# Altium project PowCapMobile.PrjPCB (part 2 of 3)
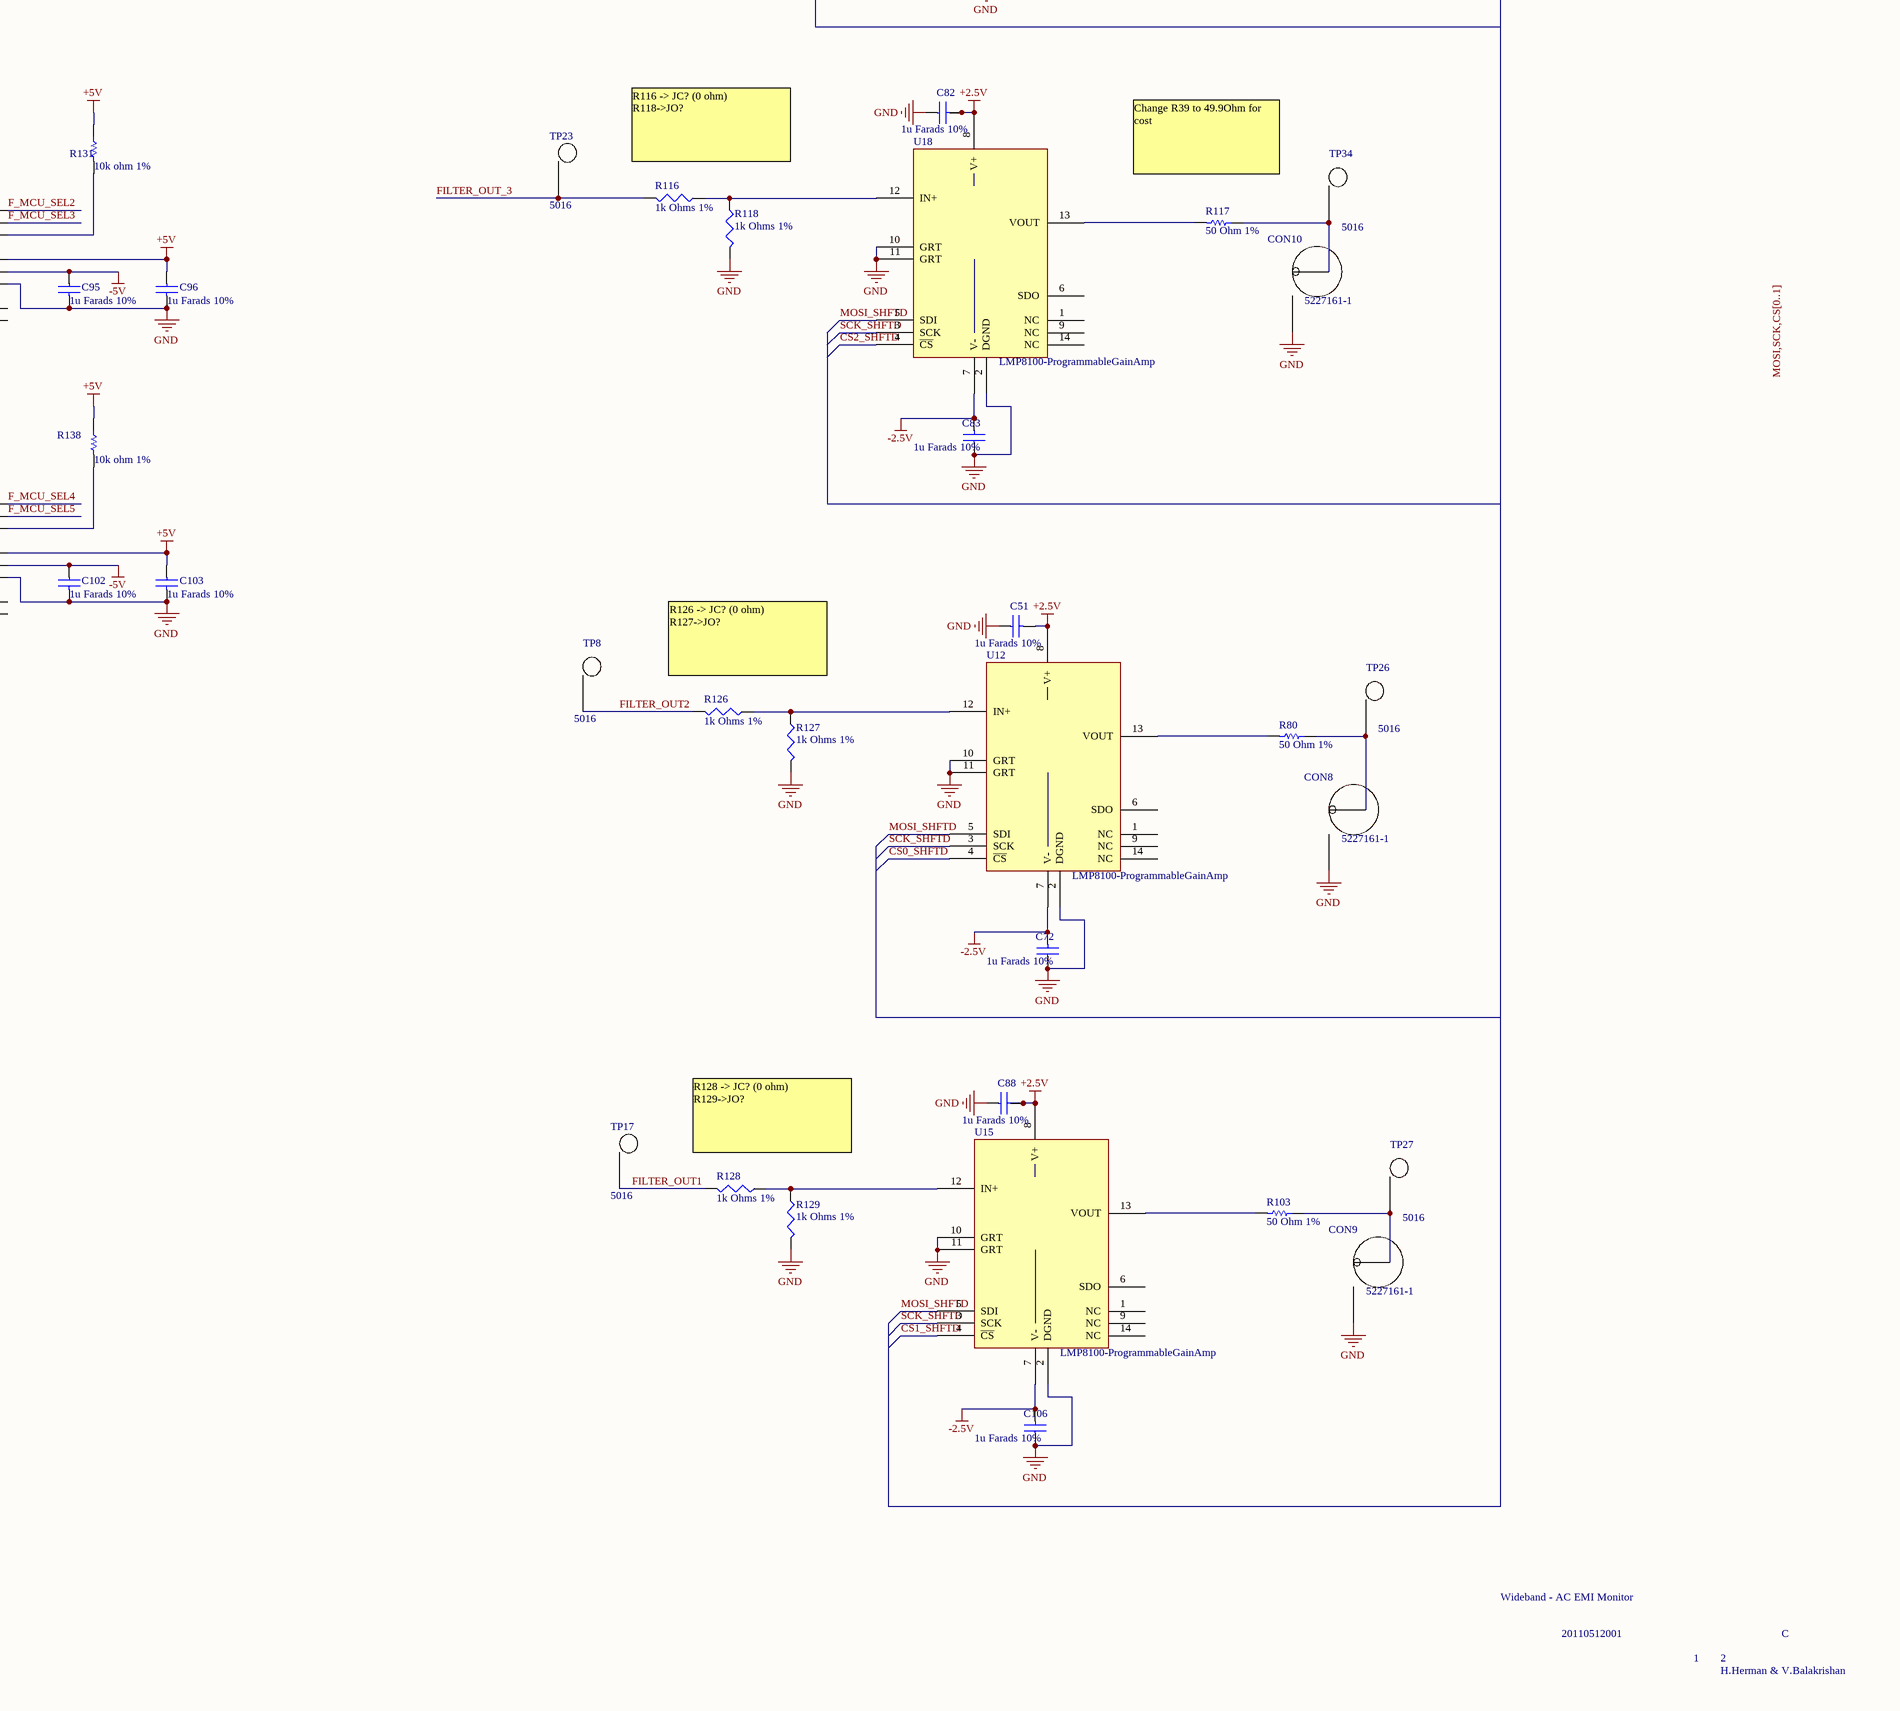
[diagram p9: PowCapMobile.SchDoc, bottom right]

## Sheet PowCapMobile.SchDoc (continued)
### Library data of the parts
BOOT RESET = 2128: SW - SPST-NO - SM; mfrName: C&K Components; Extra_Description: PTS 525 Series / Microminiature Tact Switch for SMT; Obsolete: False; Temp_Max: 0; PartID: 2128; mfrPartNum: CKN9104CT-ND; mfrWebsite: http://digikey.com/Suppliers/us/C-and-K-Components.page?lang=EN; URL_Image: http://media.digikey.com/photos/CK%20Comp%20Photos/PTS525SM10SMTR.jpg; URL_Datasheet: http://www.ck-components.com/index.php?module=media&action=Display&cmpref=14407&lang=en&width=&height=&format=&alt=; Date_Created: 2/24/2011 10:42:02 PM; Date_LastModified: 2/24/2011 10:42:02 PM; Verified: False; RoHS: True; Temp_Min: 0; Type: Pushbutton (Push Button)
C1 C3 C6 C7 C13 C18 C24 C25 = 2178: capacitor, case c, 10uf, 25v; application:general purpose;; mfrName: Panasonic; mfrPartNum: EEE1EA100SR; Label: 1uF; Extra_Description: CAPACITOR, CASE C, 10UF, 25V; Application:General Purpose; Capacitance:10µF; Tolerance, Capacitance:± 20%; Series:VS; Voltage, Rating:25V dc; Capacitor Dielectric Type:Aluminium Electrolytic; Case Style:C; External Length / Height:5.4mm; Body Diameter:5mm; Lead Spacing:1.5mm; Termination Type:SMD; Operating Temperature Range:-40°C to +85°C; AC Ripple Current:28mA; External Depth:5.3mm; Lead Length:2.2mm; Leakage Current:3µA; Operating Lifetime:2000h; Power Factor:0.14; Power Factor Frequency:120Hz; Ripple Current Frequency:120Hz; Temp, Op. Max:85°C; Temp, Op. Min:-40°C; Temperature, Operating Life:85°C; Temperature, Ripple Current:85°C; Tolerance, +:20%; Tolerance, -:20%; Voltage Rating, DC:25V; Width, External:5.3mm; Width, Lead Cross-section:0.65mm; Width, Tape:12mm / Mounting Type: ``Surface Mount`` / Lead-Free Status: ``Lead Free`` / Packaging: ``Cut Tape (CT)`` / Dielectric Material: ``Aluminum Electrolytic`` / RoHS: ``Compliant`` / Size-Height: { / ``uncertainty_minus``: null, / ``value``: 0.0054, / ``uncertainty_plus``: null / } / Voltage Rating (DC): { / ``uncertainty_minus``: null, / ``value``: 25.0, / ``uncertainty_plus``: null / } / Lead Length: { / ``uncertainty_minus``: null, / ``value``: 0.0022, / ``uncertainty_plus``: null / } / Size-Diameter: { / ``uncertainty_minus``: null, / ``value``: 0.005, / ``uncertainty_plus``: null / } / Capacitance: { / ``uncertainty_minus``: null, / ``value``: 1E-05, / ``uncertainty_plus``: null / } / Capacitance Tolerance: { / ``max_value``: 20.0, / ``max_uncertainty_plus``: null, / ``min_value``: -20.0, / ``min_uncertainty_plus``: null, / ``max_uncertainty_minus``: null / } / Operating Temperature: { / ``max_value``: 85.0, / ``max_uncertainty_plus``: null, / ``min_value``: null, / ``min_uncertainty_plus``: null, / ``max_uncertainty_minus``: null / } / Number of Pins: 2; Obsolete: False; Temp_Max: 0; Type: All Parts; TypeNotes: Applies to all parts in the database; PartID: 2178; URL_Image: http://cdn.sigma.octopart.com/8896371/image/Panasonic-EEE1EA100SR.jpg; URL_Datasheet: http://datasheet.octopart.com/EEE1EA100SR-Panasonic-datasheet-5314063.pdf; Date_Created: 5/5/2011 2:23:52 AM; Date_LastModified: 5/5/2011 2:23:52 AM; Verified: False; RoHS: True; Temp_Min: 0
C2 C26 = 2198: cap aluminum 1000uf 25vdc 20% 12.5 x 13.5mm smd 1100ma 5000; mfrName: Panasonic; mfrPartNum: EEV-FK1E102Q; Label: 1uF; Extra_Description: CAP 1000UF 25V ELECT FK SMD / Mounting Type: ``Surface Mount`` / Lead-Free Status: ``Lead Free`` / Packaging: ``Cut Tape (CT)`` / RoHS: ``Compliant`` / Voltage Rating (DC): { / ``uncertainty_minus``: null, / ``value``: 25.0, / ``uncertainty_plus``: null / } / Size-Width: { / ``uncertainty_minus``: null, / ``value``: 0.0135, / ``uncertainty_plus``: null / } / Size-Length: { / ``uncertainty_minus``: null, / ``value``: 0.015, / ``uncertainty_plus``: null / } / Size-Height: { / ``uncertainty_minus``: null, / ``value``: 0.0135, / ``uncertainty_plus``: null / } / Size-Diameter: { / ``uncertainty_minus``: null, / ``value``: 0.0125, / ``uncertainty_plus``: null / } / Capacitance: { / ``uncertainty_minus``: null, / ``value``: 0.001, / ``uncertainty_plus``: null / } / Capacitance Tolerance: { / ``max_value``: 20.0, / ``max_uncertainty_plus``: null, / ``min_value``: -20.0, / ``min_uncertainty_plus``: null, / ``max_uncertainty_minus``: null / } / Operating Temperature: { / ``max_value``: 105.0, / ``max_uncertainty_plus``: null, / ``min_value``: null, / ``min_uncertainty_plus``: null, / ``max_uncertainty_minus``: null / }; Obsolete: False; Temp_Max: 0; Type: All Parts; TypeNotes: Applies to all parts in the database; PartID: 2198; URL_Image: http://cdn.sigma.octopart.com/8933382/image/Panasonic-EEV-FK1E102Q.jpg; URL_Datasheet: http://datasheet.octopart.com/EEV-FK1E102Q-Panasonic-datasheet-48.pdf; Date_Created: 5/7/2011 2:26:18 AM; Date_LastModified: 5/7/2011 2:26:18 AM; Verified: False; RoHS: True; Temp_Min: 0
C4 C5 C16 C17 C27-C30 C33-C36 C40 C44 C45 C48 C51 C58 C59 C62-C65 C72 C75-C83 C88 C91 C92 C95 C96 C101-C103 C106 C120 C121 = 2065: CAP CER 1.0UF 10V 10% X5R 0603; mfrName: Murata Electronics North America; mfrPartNum: GRM188R61A105KA61D; Extra_Description: Datasheets	Chip Monolithic Ceramic Caps Part Numbering / GRM Series Spec/Test Methods (1) / GRM188R61A105KA61 / Product Photos	0603 Murata MLCC Caps / Product Training Modules	High-Cap Multilayer Ceramic Capacitors / Catalog Drawings	GRM Series Top, Sides / Standard Package	10 / Category	Capacitors / Family	Ceramic / Series	GRM / Capacitance	1.0µF / Voltage - Rated	10V / Tolerance	±10% / Temperature Coefficient	X5R / Mounting Type	Surface Mount, MLCC / Operating Temperature	-55°C ~ 85°C / Features	- / Applications	General Purpose / Ratings	- / Package / Case	0603 (1608 Metric) / Size / Dimension	0.063`` L x 0.032`` W (1.60mm x 0.80mm) / Lead Spacing	- / Thickness	0.80mm / Packaging	Cut Tape (CT) / Lead Style	- / Catalog Page	1886 (US2010 Interactive) / 1886 (US2010 PDF) / Other Names	490-1543-1; Obsolete: False; Temp_Max: 0; Type: Ceramic; PartID: 2065; URL_Image: HTTP://MEDIA.DIGIKEY.COM/PHOTOS/MURATA%20PHOTOS/0603%20MURATA%20MLCC%20CAPS.JPG; URL_Datasheet: http://search.murata.co.jp/Ceramy/image/img/w_hinm/L0005E.pdf; Date_Created: 9/27/2010 4:47:48 PM; Date_LastModified: 9/27/2010 4:47:48 PM; Verified: False; RoHS: True; Temp_Min: 0
C8-C12 C14 C15 C19-C21 C31 C32 C37 C38 C42 C43 C46 C47 C52-C57 C60 C61 C68-C71 C107 C108 = 2205: capacitor ceramic 1000pf, 50v, c0g, 0603; dielectric; mfrName: AVX; mfrPartNum: 06035A102FAT2A; Label: 1uF; Extra_Description: CAPACITOR CERAMIC 1000PF, 50V, C0G, 0603; Dielectric Characteristic:C0G/NP0; Capacitance:1000pF; Capacitance Tolerance:± 1%; Voltage Rating:50V; Temperature Coefficient:0 ± 30ppm/°C; Capacitor Case Style:0603; No. of Pins:2 ;RoHS Compliant: Yes / Packaging: ``Tape`` / RoHS: ``Compliant`` / Voltage Rating (DC): { / ``uncertainty_minus``: null, / ``value``: 50.0, / ``uncertainty_plus``: null / } / Capacitance: { / ``uncertainty_minus``: null, / ``value``: 1E-09, / ``uncertainty_plus``: null / } / Capacitance Tolerance: { / ``max_value``: 1.0, / ``max_uncertainty_plus``: null, / ``min_value``: -1.0, / ``min_uncertainty_plus``: null, / ``max_uncertainty_minus``: null / } / Number of Pins: 2; Obsolete: False; Temp_Max: 0; Type: All Parts; TypeNotes: Applies to all parts in the database; PartID: 2205; URL_Image: http://cdn.sigma.octopart.com/8893021/image/AVX-06035A102FAT2A.jpg; URL_Datasheet: http://datasheet.octopart.com/06035A102FAT2A-AVX-datasheet-8446347.pdf; Date_Created: 5/8/2011 9:06:39 AM; Date_LastModified: 5/8/2011 9:06:39 AM; Verified: False; RoHS: True; Temp_Min: 0
C22 C23 C66 C67 = 2202: Y2 Caps 1uF Epocs; mfrName: EPCOS; mfrPartNum: B32026B3105K; Obsolete: False; Temp_Max: 0; Type: All Parts; TypeNotes: Applies to all parts in the database; Label: 1uF; PartID: 2202; Extra_Description: Y2 Caps 1uF Epocs; URL_Image: http://www.mouser.com/images/epcos/images/812007111135.jpg; URL_Datasheet: http://www.epcos.com/inf/20/20/db/fc_2009/Y2_B32021_026.pdf; Date_Created: 5/7/2011 9:37:20 PM; Date_LastModified: 5/7/2011 9:37:20 PM; Verified: False; RoHS: True; Temp_Min: 0
C39 C41 = 2187: ceramic multilayer capacitor; capacitor type:general; mfrName: AVX; mfrPartNum: 06031A220KAT2A; Label: 1uF; Extra_Description: Ceramic Multilayer Capacitor; Capacitor Type:General Purpose; Capacitance:22pF; Capacitance Tolerance:± 10%; Voltage Rating:100VDC; Capacitor Dielectric Type:Multilayer Ceramic; Package/Case:0603; Termination Type:SMD ;RoHS Compliant: Yes / Mounting Type: ``Surface Mount`` / Lead-Free Status: ``Lead Free`` / Packaging: ``Cut Tape (CT)`` / RoHS: ``Compliant`` / Size-Width: { / ``uncertainty_minus``: null, / ``value``: 0.00081, / ``uncertainty_plus``: null / } / Size-Length: { / ``uncertainty_minus``: null, / ``value``: 0.0016, / ``uncertainty_plus``: null / } / Size-Height: { / ``uncertainty_minus``: null, / ``value``: 0.00086, / ``uncertainty_plus``: null / } / Voltage Rating (DC): { / ``uncertainty_minus``: null, / ``value``: 100.0, / ``uncertainty_plus``: null / } / Capacitance: { / ``uncertainty_minus``: null, / ``value``: 2.2E-11, / ``uncertainty_plus``: null / } / Capacitance Tolerance: { / ``max_value``: 10.0, / ``max_uncertainty_plus``: null, / ``min_value``: -10.0, / ``min_uncertainty_plus``: null, / ``max_uncertainty_minus``: null / } / Operating Temperature: { / ``max_value``: 125.0, / ``max_uncertainty_plus``: null, / ``min_value``: null, / ``min_uncertainty_plus``: null, / ``max_uncertainty_minus``: null / } / Number of Pins: 2; Obsolete: False; Temp_Max: 0; Type: All Parts; TypeNotes: Applies to all parts in the database; PartID: 2187; URL_Image: http://cdn.sigma.octopart.com/8893021/image/AVX-06031A220KAT2A.jpg; URL_Datasheet: http://datasheet.octopart.com/06031A220KAT2A-AVX-datasheet-118583.pdf; Date_Created: 5/5/2011 6:57:51 AM; Date_LastModified: 5/5/2011 6:57:51 AM; Verified: False; RoHS: True; Temp_Min: 0
C73 C74 C84 C86 C87 C89 C90 C97-C100 C105 = 2216: ceramic multilayer capacitor; capacitor type:general; mfrName: AVX; mfrPartNum: 06031A470FAT2A; Label: 1uF; Extra_Description: Ceramic Multilayer Capacitor; Capacitor Type:General Purpose; Capacitance:47pF; Capacitance Tolerance:± 1%; Voltage Rating:100VDC; Capacitor Dielectric Type:Multilayer Ceramic; Package/Case:0603; Termination Type:SMD ;RoHS Compliant: Yes / Mounting Type: ``Surface Mount`` / Lead-Free Status: ``Lead Free`` / Packaging: ``Cut Tape (CT)`` / RoHS: ``Compliant`` / Size-Width: { / ``uncertainty_minus``: null, / ``value``: 0.00081, / ``uncertainty_plus``: null / } / Size-Length: { / ``uncertainty_minus``: null, / ``value``: 0.0016, / ``uncertainty_plus``: null / } / Size-Height: { / ``uncertainty_minus``: null, / ``value``: 0.00086, / ``uncertainty_plus``: null / } / Voltage Rating (DC): { / ``uncertainty_minus``: null, / ``value``: 100.0, / ``uncertainty_plus``: null / } / Capacitance: { / ``uncertainty_minus``: null, / ``value``: 4.7E-11, / ``uncertainty_plus``: null / } / Capacitance Tolerance: { / ``max_value``: 1.0, / ``max_uncertainty_plus``: null, / ``min_value``: -1.0, / ``min_uncertainty_plus``: null, / ``max_uncertainty_minus``: null / } / Operating Temperature: { / ``max_value``: 125.0, / ``max_uncertainty_plus``: null, / ``min_value``: null, / ``min_uncertainty_plus``: null, / ``max_uncertainty_minus``: null / } / Number of Pins: 2; Obsolete: False; Temp_Max: 0; Type: All Parts; TypeNotes: Applies to all parts in the database; PartID: 2216; URL_Image: http://cdn.sigma.octopart.com/8893021/image/AVX-06031A470FAT2A.jpg; URL_Datasheet: http://datasheet.octopart.com/06031A470FAT2A-AVX-datasheet-118583.pdf; Date_Created: 5/9/2011 10:45:08 AM; Date_LastModified: 5/9/2011 10:45:08 AM; Verified: False; RoHS: True; Temp_Min: 0
C85 C93 C94 C104 = 2217: ceramic multilayer capacitor; capacitor type:general; mfrName: AVX; mfrPartNum: 06031A330FAT2A; Label: 1uF; Extra_Description: Ceramic Multilayer Capacitor; Capacitor Type:General Purpose; Capacitance:33pF; Capacitance Tolerance:± 1%; Voltage Rating:100VDC; Capacitor Dielectric Type:Multilayer Ceramic; Package/Case:0603; Termination Type:SMD ;RoHS Compliant: Yes / Mounting Type: ``Surface Mount`` / Lead-Free Status: ``Lead Free`` / Packaging: ``Cut Tape (CT)`` / RoHS: ``Compliant`` / Size-Width: { / ``uncertainty_minus``: null, / ``value``: 0.00081, / ``uncertainty_plus``: null / } / Size-Length: { / ``uncertainty_minus``: null, / ``value``: 0.0016, / ``uncertainty_plus``: null / } / Size-Height: { / ``uncertainty_minus``: null, / ``value``: 0.00086, / ``uncertainty_plus``: null / } / Voltage Rating (DC): { / ``uncertainty_minus``: null, / ``value``: 100.0, / ``uncertainty_plus``: null / } / Capacitance: { / ``uncertainty_minus``: null, / ``value``: 3.3E-11, / ``uncertainty_plus``: null / } / Capacitance Tolerance: { / ``max_value``: 1.0, / ``max_uncertainty_plus``: null, / ``min_value``: -1.0, / ``min_uncertainty_plus``: null, / ``max_uncertainty_minus``: null / } / Operating Temperature: { / ``max_value``: 125.0, / ``max_uncertainty_plus``: null, / ``min_value``: null, / ``min_uncertainty_plus``: null, / ``max_uncertainty_minus``: null / } / Number of Pins: 2; Obsolete: False; Temp_Max: 0; Type: All Parts; TypeNotes: Applies to all parts in the database; PartID: 2217; URL_Image: http://cdn.sigma.octopart.com/8893021/image/AVX-06031A330FAT2A.jpg; URL_Datasheet: http://datasheet.octopart.com/06031A330FAT2A-AVX-datasheet-118583.pdf; Date_Created: 5/9/2011 10:49:16 AM; Date_LastModified: 5/9/2011 10:49:16 AM; Verified: False; RoHS: True; Temp_Min: 0
CN1 = 289: CONN RECEPT USB MINI-B R/A 5POS SMD; mfrName: Molex/Waldom Electronics Corp; mfrPartNum: 54819-0572; Extra_Description: Molex/Waldom Electronics Corp; Lead Free StatusLead Free; RoHS StatusRoHS Compliant; Other Names WM17116CT; Obsolete: False; Temp_Max: 70; Temp_Min: -20; PartID: 289; URL_Image: http://media.digikey.com/photos/Molex/54819-0572.jpg; URL_Datasheet: http://www.mouser.com/index.cfm?handler=displayproduct&lstdispproductid=802959&e_categoryid=620&e_pcodeid=53821; Date_Created: 3/1/2006 10:26:19 PM; Date_LastModified: 8/21/2009 1:12:36 AM; Verified: False; RoHS: True; Type: USB
CON1 CON6-CON10 = 2189: jack bnc, right angle, pcb; connector type:bnc, coaxial;; mfrName: Tyco Electronics; Extra_Description: JACK BNC, RIGHT ANGLE, PCB; Connector Type:BNC, Coaxial; Impedance:50ohm; Contact Material:Phosphor Bronze; Contact Plating:Tin; Body Style:Right Angle; Termination Method:PC Board; Mounting Type:PC Board; External Depth:35.56mm; External Length / Height:13.18mm; Material:VALOX; Width, External:14.76mm; Dielectric Material:Polymethylpentene / Contact Plating: ``Tin`` / Termination Style: ``Solder Lug`` / Gender: ``Female`` / Packaging: ``Bulk`` / RoHS: ``Compliant`` / Mounting Type: ``PC Board`` / Lead-Free Status: ``Lead Free`` / Contact Material: ``Phosphor Bronze`` / Housing Material: ``Polyester`` / Color: ``White`` / Size-Height: { / ``uncertainty_minus``: null, / ``value``: 0.015875, / ``uncertainty_plus``: null / } / Frequency: { / ``max_value``: 4000000000.0, / ``max_uncertainty_plus``: null, / ``min_value``: null, / ``min_uncertainty_plus``: null, / ``max_uncertainty_minus``: null / }; Obsolete: False; Temp_Max: 0; TypeNotes: Applies to all parts in the database; PartID: 2189; mfrPartNum: 5227161-1; URL_Image: http://cdn.sigma.octopart.com/9201634/image/Tyco-Electronics-5227161-1.jpg; URL_Datasheet: http://datasheet.octopart.com/5227161-1-Tyco-Electronics-datasheet-548244.pdf; Date_Created: 5/5/2011 8:50:02 AM; Date_LastModified: 5/5/2011 8:50:02 AM; Verified: False; RoHS: True; Temp_Min: 0; Type: All Parts
CON2 = 2485
CON_FGND CON_L1 CON_L2 CON_N1 CON_N2 = 2177: brass tin plate low profile 10 - 32 thread with anti; mfrName: Keystone; Extra_Description: Brass Tin Plate Low Profile 10 - 32 Thread with Anti Rotation Tab Screw Terminal / Termination Style: ``Crimp`` / Material: ``Brass`` / Packaging: ``Bulk`` / Orientation: ``Straight`` / RoHS: ``Compliant`` / Lead-Free Status: ``Lead Free`` / Color: ``Black``; Obsolete: False; Temp_Max: 0; TypeNotes: Applies to all parts in the database; PartID: 2177; mfrPartNum: 1299; mfrWebsite: http://www.keyelco.com/; URL_Image: http://cdn.sigma.octopart.com/8947666/image/Keystone-1299.jpg; URL_Datasheet: http://datasheet.octopart.com/1299-Keystone-datasheet-23631.pdf; Date_Created: 5/5/2011 1:44:10 AM; Date_LastModified: 5/5/2011 1:44:10 AM; Verified: False; RoHS: True; Temp_Min: 0; Type: All Parts
D1-D4 = 2002: LED SUPER RED CLEAR 0603 SMD; mfrName: LITE-ON INC; mfrPartNum: LTST-C190KRKT; Extra_Description: Datasheets	LTST-C190KRKT / Product Photos	LTST-C190KGKT, LTST-C190KGKT, LTST-C190KSKT, LTST-C190KYKT / Catalog Drawings	LED 0603 Series / LED 0603 Series Side / Standard Package	1 / Category	Optoelectronics / Family	LEDs - <75mA, Discrete / Series	- / Color	Red / Luminous Flux @ Current - Test	196 mlm / Current - Test	20mA / Wavelength - Dominant	631nm / Wavelength - Peak	639nm / Millicandela Rating	54mcd / Voltage - Forward (Vf) Typ	2.0V / Lens Type	Clear / Lens Style/Size	Rectangle, 1.06mm x 0.8mm / Package / Case	0603 (1608 Metric) / Mounting Type	Surface Mount / Viewing Angle	130° / Packaging	Cut Tape (CT) / Size / Dimension	* / Height	* / Catalog Page	2744 (US2010 Interactive) / 2744 (US2010 PDF) / Other Names	160-1436-1; Obsolete: False; Temp_Max: 0; Type: UNKNOWN; Published: 8-Jun-2000; LatestRevisionDate: 17-Jul-2002; LatestRevisionNote: Re-released for DXP Platform.; PackageVersion: Feb-2002; PackageReference: 3.2X1.6X1.1; Publisher: Altium Limited; PartID: 2002; URL_Image: http://media.digikey.com/photos/Lite%20On%20Photos/LTST-C190KGKT,LTST-C190KRKT,LTST-C190KSKT,LTST-C190KYKT_sml.jpg; URL_Datasheet: http://optoelectronics.liteon.com/en-us/api/DwonloadFileHandler.ashx?txtSpecNo=DS-22-99-0151&txtPartNo=LTST-C190KRKT; Date_Created: 7/8/2010 11:36:30 PM; Date_LastModified: 7/8/2010 11:36:30 PM; Verified: False; RoHS: True; Temp_Min: 0
D_STAT1-D_STAT4 = 2002: LED SUPER RED CLEAR 0603 SMD; mfrName: LITE-ON INC; mfrPartNum: LTST-C190KRKT; Extra_Description: Datasheets	LTST-C190KRKT / Product Photos	LTST-C190KGKT, LTST-C190KGKT, LTST-C190KSKT, LTST-C190KYKT / Catalog Drawings	LED 0603 Series / LED 0603 Series Side / Standard Package	1 / Category	Optoelectronics / Family	LEDs - <75mA, Discrete / Series	- / Color	Red / Luminous Flux @ Current - Test	196 mlm / Current - Test	20mA / Wavelength - Dominant	631nm / Wavelength - Peak	639nm / Millicandela Rating	54mcd / Voltage - Forward (Vf) Typ	2.0V / Lens Type	Clear / Lens Style/Size	Rectangle, 1.06mm x 0.8mm / Package / Case	0603 (1608 Metric) / Mounting Type	Surface Mount / Viewing Angle	130° / Packaging	Cut Tape (CT) / Size / Dimension	* / Height	* / Catalog Page	2744 (US2010 Interactive) / 2744 (US2010 PDF) / Other Names	160-1436-1; Obsolete: False; Temp_Max: 0; Published: 8-Jun-2000; LatestRevisionDate: 17-Jul-2002; LatestRevisionNote: Re-released for DXP Platform.; PackageVersion: Feb-2002; PackageReference: 3.2X1.6X1.1; Publisher: Altium Limited; PartID: 2002; URL_Image: http://media.digikey.com/photos/Lite%20On%20Photos/LTST-C190KGKT,LTST-C190KRKT,LTST-C190KSKT,LTST-C190KYKT_sml.jpg; URL_Datasheet: http://optoelectronics.liteon.com/en-us/api/DwonloadFileHandler.ashx?txtSpecNo=DS-22-99-0151&txtPartNo=LTST-C190KRKT; Date_Created: 7/8/2010 11:36:30 PM; Date_LastModified: 7/8/2010 11:36:30 PM; Verified: False; RoHS: True; Temp_Min: 0; Type: UNKNOWN
F1-F3 = 1045: FUSEHOLDER OPEN 5X20MM PC MNT; mfrName: Wickmann USA, Inc.; mfrPartNum: 6490000100; Extra_Description: Wickmann USA, Inc. / TypeHolder / Fuse Size5mm x 20mm / MountingPCB / SpecificationsMiniature / MaterialThermoplastic, Black / Other Names19649 / 649 / WK0011; Type: Fuseholders; PartID: 1045; URL_Image: http://media.digikey.com/photos/Wickmann%20Photos/6490000100_sml.jpg; URL_Datasheet: http://www.digikey.com/scripts/DkSearch/dksus.dll?Pname?Name=WK0011-ND&Site=US; Date_Created: 8/1/2004 3:23:57 AM; Date_LastModified: 8/21/2009 1:12:53 AM; Verified: False
R1 R2 R4 R8-R14 R18 R21 R28 R36 R38 R40 R45 R46 R48 R51 R52 R57 R60 R70 R85 R86 R88 R101 R104 R105 R111-R113 R115 R116 R118 R126-R129 = 2043: RES 1.00K OHM 1/10W 1% 0603 SMD; mfrName: Panasonic - ECG; mfrPartNum: ERJ-3EKF1001V; Extra_Description: Datasheets	ERJ-3EKF1001V View All Specifications / Product Photos	0603 Pkg / Catalog Drawings	1% Thick Film Chip Material / 1% Thick Film Chip / Standard Package	200 / Category	Resistors / Family	Chip Resistor - Surface Mount / Series	ERJ / Resistance In Ohms	1.00K / Power (Watts)	0.1W, 1/10W / Composition	Thick Film / Features	- / Temperature Coefficient	±100ppm/°C / Tolerance	±1% / Case	0603 (1608 metric) / Size / Dimension	0.063`` L x 0.031`` W (1.60mm x 0.80mm) / Height	0.018`` (0.45mm) / Lead Style	Surface Mount (SMD - SMT) / Packaging	Cut Tape (CT) / Catalog Page	1954 (US2010 Interactive) / 1954 (US2010 PDF) / Kits	RSM3H-ND - KIT CHIP RES 96 VALUES 50EA 0603 / Other Names	ERJ-3EKF1001 / ERJ3EKF1001 / P1.00KHCT; Obsolete: False; Temp_Max: 0; PartID: 2043; URL_Image: http://media.digikey.com/photos/Panasonic%20Photos/10-0603%20Resistor.jpg?cshift_ck=null&client_id=5042; URL_Datasheet: http://industrial.panasonic.com/www-cgi/jvcr13pz.cgi?E+PZ+3+AOA0002+ERJ3EKF1001V+7+WW; Date_Created: 9/14/2010 11:34:31 AM; Date_LastModified: 9/14/2010 11:34:31 AM; Verified: False; RoHS: True; Temp_Min: 0; Type: Chip Resistor - Surface Mount
R3 R7 R15 R24 R56 R144-R146 = 2070: RES 330 OHM 1/10W 1% 0603 SMD; mfrName: Panasonic - ECG; mfrPartNum: ERJ-3EKF3300V; Extra_Description: Datasheets	ERJ-3EKF3300V View All Specifications / Product Photos	0603 Pkg / Catalog Drawings	1% Thick Film Chip Material / 1% Thick Film Chip / Standard Package	200 / Category	Resistors / Family	Chip Resistor - Surface Mount / Series	ERJ / Resistance In Ohms	330 / Power (Watts)	0.1W, 1/10W / Composition	Thick Film / Features	- / Temperature Coefficient	±100ppm/°C / Tolerance	±1% / Case	0603 (1608 metric) / Size / Dimension	0.063`` L x 0.031`` W (1.60mm x 0.80mm) / Height	0.018`` (0.45mm) / Lead Style	Surface Mount (SMD - SMT) / Packaging	Cut Tape (CT) / Catalog Page	1954 (US2010 Interactive) / 1954 (US2010 PDF) / Other Names	P330HCT; Obsolete: False; Temp_Max: 0; PartID: 2070; URL_Image: HTTP://MEDIA.DIGIKEY.COM/PHOTOS/PANASONIC%20PHOTOS/10-0603%20RESISTOR.JPG; URL_Datasheet: http://industrial.panasonic.com/www-cgi/jvcr13pz.cgi?E+PZ+3+AOA0002+ERJ3EKF3300V+7+WW; Date_Created: 9/27/2010 6:42:19 PM; Date_LastModified: 9/27/2010 6:42:19 PM; Verified: False; RoHS: True; Temp_Min: 0; Type: Chip Resistor - Surface Mount
R5 R34 R44 R53 R78 R82 R110 R131 R138 = 2165: resistor, 0603, 0.1w, 1%, 10k; resistance:10kohm; resistance; mfrName: Panasonic; mfrPartNum: ERJ-3EKF1002V; Value: 1K; Extra_Description: RESISTOR, 0603, 0.1W, 1%, 10K; Resistance:10kohm; Resistance Tolerance:± 1%; Power Rating:0.1W; Voltage Rating:75V; Series:ERJ; Temperature Coefficient:± 200ppm/°C; Resistor Element Type:Thick Film; Resistor Case Style:0603; No. of Pins:2; Case Style:0603; External Length / Height:0.45mm; External Depth:0.8mm; External Width:1.6mm; Operating Temperature Range:-55°C to +155°C; Overload Voltage:150V; Reel Quantity:5000; Termination Type:SMD / Mounting Type: ``Surface Mount`` / Case / Package: ``0603`` / Packaging: ``Cut Tape (CT)`` / Lead-Free Status: ``Contains Lead`` / RoHS: ``Compliant`` / Resistance: { / ``uncertainty_minus``: null, / ``value``: 10000.0, / ``uncertainty_plus``: null / } / Voltage Rating (DC): { / ``uncertainty_minus``: null, / ``value``: 75.0, / ``uncertainty_plus``: null / } / Size-Width: { / ``uncertainty_minus``: null, / ``value``: 0.0008, / ``uncertainty_plus``: null / } / Size-Length: { / ``uncertainty_minus``: null, / ``value``: 0.0016, / ``uncertainty_plus``: null / } / Size-Height: { / ``uncertainty_minus``: null, / ``value``: 0.00045, / ``uncertainty_plus``: null / } / Power Rating: { / ``uncertainty_minus``: null, / ``value``: 0.1, / ``uncertainty_plus``: null / } / Resistance Tolerance: { / ``max_value``: 1.0, / ``max_uncertainty_plus``: null, / ``min_value``: -1.0, / ``min_uncertainty_plus``: null, / ``max_uncertainty_minus``: null / } / Operating Temperature: { / ``max_value``: 125.0, / ``max_uncertainty_plus``: null, / ``min_value``: null, / ``min_uncertainty_plus``: null, / ``max_uncertainty_minus``: null / } / Number of Pins: 2; Obsolete: False; Temp_Max: 0; TypeNotes: Applies to all parts in the database; Published: 8-Jun-2000; LatestRevisionDate: 17-Jul-2002; LatestRevisionNote: Re-released for DXP Platform.; PackageReference: AXIAL-0.3; Publisher: Altium Limited; PartID: 2165; URL_Image: http://cdn.sigma.octopart.com/8893006/image/Panasonic-ERJ-3EKF1002V.jpg; URL_Datasheet: http://datasheet.octopart.com/ERJ-3EKF1002V-Panasonic-datasheet-118621.pdf; Date_Created: 4/24/2011 7:23:38 AM; Date_LastModified: 4/24/2011 7:23:38 AM; Verified: False; RoHS: True; Temp_Min: 0; Type: All Parts
R6 R35 = 2182: resistor, thick film, 30kohm, 100mw, 1%; resistance:30kohm;; mfrName: Yageo; mfrPartNum: RC0603FR-0730KL; Value: 1K; Extra_Description: RESISTOR, THICK FILM, 30KOHM, 100mW, 1%; Resistance:30kohm; Resistance Tolerance:± 1%; Power Rating:100mW; Voltage Rating:50V; Series:RC0603; Temperature Coefficient:± 100ppm/°C; Resistor Element Material:Thick Film ;RoHS Compliant: Yes / Mounting Type: ``Surface Mount`` / Case / Package: ``0603`` / Packaging: ``Cut Tape (CT)`` / Lead-Free Status: ``Lead Free`` / RoHS: ``Compliant`` / Resistance: { / ``uncertainty_minus``: null, / ``value``: 30000.0, / ``uncertainty_plus``: null / } / Voltage Rating (DC): { / ``uncertainty_minus``: null, / ``value``: 50.0, / ``uncertainty_plus``: null / } / Size-Width: { / ``uncertainty_minus``: null, / ``value``: 0.0008, / ``uncertainty_plus``: null / } / Size-Length: { / ``uncertainty_minus``: null, / ``value``: 0.0016, / ``uncertainty_plus``: null / } / Size-Height: { / ``uncertainty_minus``: null, / ``value``: 0.00045, / ``uncertainty_plus``: null / } / Power Rating: { / ``uncertainty_minus``: null, / ``value``: 0.1, / ``uncertainty_plus``: null / } / Resistance Tolerance: { / ``max_value``: 1.0, / ``max_uncertainty_plus``: null, / ``min_value``: -1.0, / ``min_uncertainty_plus``: null, / ``max_uncertainty_minus``: null / } / Operating Temperature: { / ``max_value``: 155.0, / ``max_uncertainty_plus``: null, / ``min_value``: null, / ``min_uncertainty_plus``: null, / ``max_uncertainty_minus``: null / }; Obsolete: False; Temp_Max: 0; TypeNotes: Applies to all parts in the database; Published: 8-Jun-2000; LatestRevisionDate: 17-Jul-2002; LatestRevisionNote: Re-released for DXP Platform.; PackageReference: AXIAL-0.3; Publisher: Altium Limited; PartID: 2182; URL_Image: http://cdn.sigma.octopart.com/8619856/image/Yageo-RC0603FR-0730KL.jpg; URL_Datasheet: http://datasheet.octopart.com/RC0603FR-0730KL-Yageo-datasheet-118562.pdf; Date_Created: 5/5/2011 4:03:11 AM; Date_LastModified: 5/5/2011 4:03:11 AM; Verified: False; RoHS: True; Temp_Min: 0; Type: All Parts
R16 R17 R19 R20 R22 R23 R25 R26 R29-R31 R41 R42 R49 R50 R54 R55 R58 R59 R71-R75 R77 R79 R81 R87 R99 R100 R107 R108 = 2206: res, thick film, 2.7mohm, 100mw, 1%; resistance:2.7mohm;; mfrName: Vishay; mfrPartNum: CRCW06032M70FKEA; Value: 1K; Extra_Description: RES, THICK FILM, 2.7MOHM, 100mW, 1%; Resistance:2.7Mohm; Resistance Tolerance:± 1%; Power Rating:100mW; Series:CRCW; Temperature Coefficient:± 100ppm; Resistor Element Material:Thick Film; Resistor Case Style:0603; No. of Pins:2 ;RoHS Compliant: Yes / Mounting Type: ``Surface Mount`` / Case / Package: ``0603`` / Packaging: ``Cut Tape (CT)`` / Lead-Free Status: ``Lead Free`` / RoHS: ``Compliant`` / Power Rating: { / ``uncertainty_minus``: null, / ``value``: 0.1, / ``uncertainty_plus``: null / } / Resistance: { / ``uncertainty_minus``: null, / ``value``: 2700000.0, / ``uncertainty_plus``: null / } / Size-Height: { / ``uncertainty_minus``: null, / ``value``: 0.00045, / ``uncertainty_plus``: null / } / Size-Length: { / ``uncertainty_minus``: null, / ``value``: 0.00155, / ``uncertainty_plus``: null / } / Size-Width: { / ``uncertainty_minus``: null, / ``value``: 0.00085, / ``uncertainty_plus``: null / } / Resistance Tolerance: { / ``max_value``: 1.0, / ``max_uncertainty_plus``: null, / ``min_value``: -1.0, / ``min_uncertainty_plus``: null, / ``max_uncertainty_minus``: null / } / Operating Temperature: { / ``max_value``: 150.0, / ``max_uncertainty_plus``: null, / ``min_value``: null, / ``min_uncertainty_plus``: null, / ``max_uncertainty_minus``: null / }; Obsolete: False; Temp_Max: 0; TypeNotes: Applies to all parts in the database; Published: 8-Jun-2000; LatestRevisionDate: 17-Jul-2002; LatestRevisionNote: Re-released for DXP Platform.; PackageReference: AXIAL-0.3; Publisher: Altium Limited; PartID: 2206; URL_Image: http://cdn.sigma.octopart.com/8893816/image/Vishay-CRCW06032M70FKEA.jpg; URL_Datasheet: http://datasheet.octopart.com/CRCW06032M70FKEA-Vishay-datasheet-8445837.pdf; Date_Created: 5/8/2011 9:12:23 AM; Date_LastModified: 5/8/2011 9:12:23 AM; Verified: False; RoHS: True; Temp_Min: 0; Type: All Parts
R27 R32 R33 R84 R93 R94 = 2233: Resistor; mfrName: Panasonic; mfrPartNum: ERO-S2PHF3002-2; Value: 1K; Extra_Description: 30k 1%; Obsolete: False; Temp_Max: 0; TypeNotes: Applies to all parts in the database; Published: 8-Jun-2000; LatestRevisionDate: 17-Jul-2002; LatestRevisionNote: Re-released for DXP Platform.; PackageReference: AXIAL-0.3; Publisher: Altium Limited; PartID: 2233; URL_Image: http://www.mouser.com/images/panasonic/images/prod_res_lpr_ero.jpg; URL_Datasheet: http://www-images.panasonic.com/industrial/components/pdf/AOA0000CE14.pdf; Date_Created: 5/13/2011 10:37:42 AM; Date_LastModified: 5/13/2011 10:37:42 AM; Verified: False; RoHS: True; Temp_Min: 0; Type: All Parts
R37 R76 R83 R97 R98 R102 R109 R120-R125 = 2207: res thick film 0603 0 ohm 1/10w molded smd punched carrier; mfrName: Panasonic; mfrPartNum: ERJ-3GEY0R00V; Value: 1K; Extra_Description: RES 0.0 OHM 1/10W 0603 SMD / Mounting Type: ``Surface Mount`` / Case / Package: ``0603`` / Packaging: ``Cut Tape (CT)`` / Lead-Free Status: ``Lead Free`` / RoHS: ``Compliant`` / Size-Width: { / ``uncertainty_minus``: null, / ``value``: 0.0008, / ``uncertainty_plus``: null / } / Resistance: { / ``uncertainty_minus``: null, / ``value``: 0.0, / ``uncertainty_plus``: null / } / Size-Height: { / ``uncertainty_minus``: null, / ``value``: 0.00045, / ``uncertainty_plus``: null / } / Size-Length: { / ``uncertainty_minus``: null, / ``value``: 0.0016, / ``uncertainty_plus``: null / } / Resistance Tolerance: { / ``max_value``: 5.0, / ``max_uncertainty_plus``: null, / ``min_value``: -5.0, / ``min_uncertainty_plus``: null, / ``max_uncertainty_minus``: null / } / Operating Temperature: { / ``max_value``: 125.0, / ``max_uncertainty_plus``: null, / ``min_value``: null, / ``min_uncertainty_plus``: null, / ``max_uncertainty_minus``: null / }; Obsolete: False; Temp_Max: 0; TypeNotes: Applies to all parts in the database; Published: 8-Jun-2000; LatestRevisionDate: 17-Jul-2002; LatestRevisionNote: Re-released for DXP Platform.; PackageReference: AXIAL-0.3; Publisher: Altium Limited; PartID: 2207; URL_Image: http://cdn.sigma.octopart.com/8893006/image/Panasonic-ERJ-3GEY0R00V.jpg; URL_Datasheet: http://datasheet.octopart.com/ERJ-3GEY0R00V-Panasonic-datasheet-118655.pdf; Date_Created: 5/8/2011 9:32:29 AM; Date_LastModified: 5/8/2011 9:32:29 AM; Verified: False; RoHS: True; Temp_Min: 0; Type: All Parts
R39 R80 R103 R106 R114 R117 = 2208: ; resistance:50ohm; resistance tolerance:± 0.1%; power; mfrName: Vishay; mfrPartNum: FC0603E50R0BTBST1; Value: 1K; Extra_Description: ; Resistance:50ohm; Resistance Tolerance:± 0.1%; Power Rating:125mW; Voltage Rating:50V; Temperature Coefficient:± 25ppm/°C; Resistor Element Material:Thin Film; Resistor Case Style:0603; No. of Pins:2 / Power Rating: { / ``uncertainty_minus``: null, / ``value``: 0.125, / ``uncertainty_plus``: null / } / Resistance: { / ``uncertainty_minus``: null, / ``value``: 50.0, / ``uncertainty_plus``: null / } / Voltage Rating (DC): { / ``uncertainty_minus``: null, / ``value``: 50.0, / ``uncertainty_plus``: null / } / Resistance Tolerance: { / ``max_value``: 0.1, / ``max_uncertainty_plus``: null, / ``min_value``: -0.1, / ``min_uncertainty_plus``: null, / ``max_uncertainty_minus``: null / } / Number of Pins: 2; Obsolete: False; Temp_Max: 0; TypeNotes: Applies to all parts in the database; Published: 8-Jun-2000; LatestRevisionDate: 17-Jul-2002; LatestRevisionNote: Re-released for DXP Platform.; PackageReference: AXIAL-0.3; Publisher: Altium Limited; PartID: 2208; URL_Image: http://cdn.sigma.octopart.com/8908821/image/Vishay-FC0603E50R0BTBST1.jpg; URL_Datasheet: http://; Date_Created: 5/8/2011 9:43:35 AM; Date_LastModified: 5/8/2011 9:43:35 AM; Verified: False; RoHS: True; Temp_Min: 0; Type: All Parts
R43 R47 = 2185: rating:75v; temperature coefficient; mfrName: Panasonic; mfrPartNum: ERJ3EKF22R0V; Value: 1K; Extra_Description: RESISTOR, 0603, 0.1W, 1%, 22R; Resistance:22ohm; Resistance Tolerance:± 1%; Power Rating:0.1W; Voltage Rating:75V; Series:ERJ; Temperature Coefficient:± 200ppm/°C; Resistor Element Type:Thick Film; Resistor Case Style:0603; No. of Pins:2; Case Style:0603; External Length / Height:0.45mm; External Depth:0.8mm; External Width:1.6mm; Operating Temperature Range:-55°C to +155°C; Overload Voltage:150V; Reel Quantity:5000; Termination Type:SMD; Obsolete: False; Temp_Max: 0; TypeNotes: Applies to all parts in the database; Published: 8-Jun-2000; LatestRevisionDate: 17-Jul-2002; LatestRevisionNote: Re-released for DXP Platform.; PackageReference: AXIAL-0.3; Publisher: Altium Limited; PartID: 2185; URL_Image: http://cdn.sigma.octopart.com/8893006/image/Panasonic-ERJ3EKF22R0V.jpg; URL_Datasheet: http://datasheet.octopart.com/ERJ3EKF22R0V-Panasonic-datasheet-5313456.pdf; Date_Created: 5/5/2011 6:06:39 AM; Date_LastModified: 5/5/2011 6:06:39 AM; Verified: False; RoHS: True; Temp_Min: 0; Type: All Parts
R89 R119 R130 R139 = 2219: resistor, rc22h 0603 33k; power rating:0.1w;; mfrName: Yageo; mfrPartNum: RC0603FR-0733KL; Value: 1K; Extra_Description: RESISTOR, RC22H 0603 33K; Power Rating:0.1W; Resistance:33kohm; Resistance Tolerance:± 1%; Series:RC22H; Operating Temperature Range:-55°C to +125°C; Resistor Element Type:Thick Film; Voltage Rating:50V dc; Temperature Coefficient:± 250ppm/°C; Case Style:0603; External Length / Height:1.6mm; Temperature Coeff. -:250ppm/°C; Tempperature Coeff. +:250ppm/°C; Tolerance, +:1%; Tolerance, -:1%; Voltage Rating DC:50V; External Depth:0.45mm; External Width:0.8mm; Full Power Rating Temperature:70°C; Max Operating Temperature:125°C; Min Temperature Operating:-55°C; Reel Quantity:5000; Termination Type:SMD; Lead Spacing:0.3mm; Resistor Case Style:0603 / Mounting Type: ``Surface Mount`` / Case / Package: ``0603`` / Packaging: ``Cut Tape (CT)`` / Lead-Free Status: ``Lead Free`` / RoHS: ``Compliant`` / Resistance: { / ``uncertainty_minus``: null, / ``value``: 33000.0, / ``uncertainty_plus``: null / } / Voltage Rating (DC): { / ``uncertainty_minus``: null, / ``value``: 50.0, / ``uncertainty_plus``: null / } / Size-Width: { / ``uncertainty_minus``: null, / ``value``: 0.0008, / ``uncertainty_plus``: null / } / Size-Length: { / ``uncertainty_minus``: null, / ``value``: 0.0016, / ``uncertainty_plus``: null / } / Size-Height: { / ``uncertainty_minus``: null, / ``value``: 0.00045, / ``uncertainty_plus``: null / } / Power Rating: { / ``uncertainty_minus``: null, / ``value``: 0.1, / ``uncertainty_plus``: null / } / Resistance Tolerance: { / ``max_value``: 1.0, / ``max_uncertainty_plus``: null, / ``min_value``: -1.0, / ``min_uncertainty_plus``: null, / ``max_uncertainty_minus``: null / } / Operating Temperature: { / ``max_value``: 155.0, / ``max_uncertainty_plus``: null, / ``min_value``: null, / ``min_uncertainty_plus``: null, / ``max_uncertainty_minus``: null / } / Number of Pins: 2; Obsolete: False; Temp_Max: 0; TypeNotes: Applies to all parts in the database; Published: 8-Jun-2000; LatestRevisionDate: 17-Jul-2002; LatestRevisionNote: Re-released for DXP Platform.; PackageReference: AXIAL-0.3; Publisher: Altium Limited; PartID: 2219; URL_Image: http://cdn.sigma.octopart.com/8893411/image/Yageo-RC0603FR-0733KL.jpg; URL_Datasheet: http://datasheet.octopart.com/RC0603FR-0733KL-Yageo-datasheet-118562.pdf; Date_Created: 5/9/2011 11:31:23 AM; Date_LastModified: 5/9/2011 11:31:23 AM; Verified: False; RoHS: True; Temp_Min: 0; Type: All Parts
R91 R132 R133 R140 = 2218: res thick film 0603 49.9k ohm 1% 1/10w ±100ppm/°c molded smd; mfrName: Panasonic; mfrPartNum: ERJ-3EKF4992V; Value: 1K; Extra_Description: Res Thick Film 0603 49.9K Ohm 1% 1/10W ±100ppm/°C Molded SMD Punched Carrier T/R / Mounting Type: ``Surface Mount`` / Case / Package: ``0603`` / Packaging: ``Cut Tape (CT)`` / Lead-Free Status: ``Lead Free`` / RoHS: ``Compliant`` / Size-Width: { / ``uncertainty_minus``: null, / ``value``: 0.0008, / ``uncertainty_plus``: null / } / Resistance: { / ``uncertainty_minus``: null, / ``value``: 49900.0, / ``uncertainty_plus``: null / } / Size-Height: { / ``uncertainty_minus``: null, / ``value``: 0.00045, / ``uncertainty_plus``: null / } / Size-Length: { / ``uncertainty_minus``: null, / ``value``: 0.0016, / ``uncertainty_plus``: null / } / Resistance Tolerance: { / ``max_value``: 1.0, / ``max_uncertainty_plus``: null, / ``min_value``: -1.0, / ``min_uncertainty_plus``: null, / ``max_uncertainty_minus``: null / } / Operating Temperature: { / ``max_value``: 125.0, / ``max_uncertainty_plus``: null, / ``min_value``: null, / ``min_uncertainty_plus``: null, / ``max_uncertainty_minus``: null / }; Obsolete: False; Temp_Max: 0; TypeNotes: Applies to all parts in the database; Published: 8-Jun-2000; LatestRevisionDate: 17-Jul-2002; LatestRevisionNote: Re-released for DXP Platform.; PackageReference: AXIAL-0.3; Publisher: Altium Limited; PartID: 2218; URL_Image: http://cdn.sigma.octopart.com/8893006/image/Panasonic-ERJ-3EKF4992V.jpg; URL_Datasheet: http://datasheet.octopart.com/ERJ-3EKF4992V-Panasonic-datasheet-118621.pdf; Date_Created: 5/9/2011 11:28:00 AM; Date_LastModified: 5/9/2011 11:28:00 AM; Verified: False; RoHS: True; Temp_Min: 0; Type: All Parts
R95 R96 R134-R137 R141 R142 = 2220: resistor, rc22h 0603 12k; resistance:12kohm; resistance; mfrName: Yageo; mfrPartNum: RC0603FR-0712KL; Value: 1K; Extra_Description: RESISTOR, RC22H 0603 12K; Resistance:12kohm; Resistance Tolerance:± 1%; Power Rating:0.1W; Voltage Rating:50V dc; Series:RC22H; Temperature Coefficient:± 250ppm/°C; Resistor Element Type:Thick Film; Resistor Case Style:0603; No. of Pins:2; SVHC:No SVHC; Case Style:0603; External Length / Height:1.6mm; Temperature Coeff. +:250ppm/°C; Temperature Coeff. -:250ppm/°C; Tolerance, +:1%; Tolerance, -:1%; Voltage Rating DC:50V; External Depth:0.45mm; External Width:0.8mm; Full Power Rating Temperature:70°C; Max Operating Temperature:125°C; Min Temperature Operating:-55°C; Operating Temperature Range:-55°C to +125°C; Reel Quantity:5000; Termination Type:SMD; Lead Spacing:0.3mm / Mounting Type: ``Surface Mount`` / Case / Package: ``0603`` / Packaging: ``Cut Tape (CT)`` / Lead-Free Status: ``Lead Free`` / RoHS: ``Compliant`` / Resistance: { / ``uncertainty_minus``: null, / ``value``: 12000.0, / ``uncertainty_plus``: null / } / Voltage Rating (DC): { / ``uncertainty_minus``: null, / ``value``: 50.0, / ``uncertainty_plus``: null / } / Size-Width: { / ``uncertainty_minus``: null, / ``value``: 0.0008, / ``uncertainty_plus``: null / } / Size-Length: { / ``uncertainty_minus``: null, / ``value``: 0.0016, / ``uncertainty_plus``: null / } / Size-Height: { / ``uncertainty_minus``: null, / ``value``: 0.00045, / ``uncertainty_plus``: null / } / Power Rating: { / ``uncertainty_minus``: null, / ``value``: 0.1, / ``uncertainty_plus``: null / } / Resistance Tolerance: { / ``max_value``: 1.0, / ``max_uncertainty_plus``: null, / ``min_value``: -1.0, / ``min_uncertainty_plus``: null, / ``max_uncertainty_minus``: null / } / Operating Temperature: { / ``max_value``: 155.0, / ``max_uncertainty_plus``: null, / ``min_value``: null, / ``min_uncertainty_plus``: null, / ``max_uncertainty_minus``: null / } / Number of Pins: 2; Obsolete: False; Temp_Max: 0; TypeNotes: Applies to all parts in the database; Published: 8-Jun-2000; LatestRevisionDate: 17-Jul-2002; LatestRevisionNote: Re-released for DXP Platform.; PackageReference: AXIAL-0.3; Publisher: Altium Limited; PartID: 2220; URL_Image: http://cdn.sigma.octopart.com/8893411/image/Yageo-RC0603FR-0712KL.jpg; URL_Datasheet: http://datasheet.octopart.com/RC0603FR-0712KL-Yageo-datasheet-118562.pdf; Date_Created: 5/9/2011 11:39:05 AM; Date_LastModified: 5/9/2011 11:39:05 AM; Verified: False; RoHS: True; Temp_Min: 0; Type: All Parts
TP1 TP2 TP2V5 TP3-TP5 TP5V TP6-TP27 TP34 TP-5V TP_-2V5 TP_CS0-TP_CS3 TP_F0-TP_F7 TP_GND TP_GND2 TP_MISO TP_MOSI TP_SCK TPSCL TPSDA = 2231: test point, connector; connector type:test; mounting type:pc; mfrName: Keystone; Extra_Description: Compact Surface Mount Test Points on Tape and Reel / Material: ``Phosphor Bronze`` / Packaging: ``Cut Tape (CT)`` / RoHS: ``Compliant`` / Mounting Type: ``Surface Mount`` / Lead-Free Status: ``Lead Free`` / Contact Material: ``Phosphor Bronze`` / Insulation Material: ``Polycarbonate`` / Size-Width: { / ``uncertainty_minus``: null, / ``value``: 0.001016, / ``uncertainty_plus``: null / } / Size-Length: { / ``uncertainty_minus``: null, / ``value``: 0.00381, / ``uncertainty_plus``: null / } / Size-Height: { / ``uncertainty_minus``: null, / ``value``: 0.002286, / ``uncertainty_plus``: null / }; Obsolete: False; Temp_Max: 0; TypeNotes: Applies to all parts in the database; PartID: 2231; mfrPartNum: 5016; mfrWebsite: http://www.keyelco.com/; URL_Image: http://cdn.sigma.octopart.com/9140493/image/Keystone-5016.jpg; URL_Datasheet: http://datasheet.octopart.com/5016-Keystone-datasheet-23674.pdf; Date_Created: 5/13/2011 7:38:09 AM; Date_LastModified: 5/13/2011 7:38:09 AM; Verified: False; RoHS: True; Temp_Min: 0; Type: All Parts
TVS1-TVS4 = 2519: TVS 400W 12V BIDIRECT SMA; mfrName: Micro Commercial Co.; Extra_Description: Datasheets	SMAJ5.0 thru SMAJ440CA / Product Photos	SMA, DO-214AC BIDIRECT / Product Training Modules	Transient Voltage Suppressors / Diode Handling and Mounting / Catalog Drawings	SMA Series Top / Featured Product	Surface Mount TVS / Standard Package	1 / Category	Circuit Protection / Family	TVS - Diodes / Series	- / Voltage - Reverse Standoff (Typ)	12V / Voltage - Breakdown	13.3V / Power (Watts)	400W / Polarization	Bidirectional / Mounting Type	Surface Mount / Package / Case	DO-214AC, SMA / Supplier Device Package	SMA / Packaging	Cut Tape (CT) / Other Names	SMAJ12CA-TPMSCT; Obsolete: False; Temp_Max: 0; TypeNotes: Applies to all parts in the database; PartID: 2519; mfrPartNum: SMAJ12CA-TP; URL_Image: http://media.digikey.com/photos/Micro%20Commercial%20Photos/SMAJ8.5CA-TP.JPG; URL_Datasheet: http://61.222.192.61/mccsemi/up_pdf/SMAJ5.0~SMAJ440CA(SMA).pdf; Date_Created: 2/24/2012 10:06:52 PM; Date_LastModified: 2/24/2012 10:06:52 PM; Verified: False; RoHS: True; Temp_Min: 0; Type: All Parts
U1 U3 U7 U10 U13 U23 = 2191: op amp, dual, r-r, 180mhz, 8msop; op amp type:unity gain; mfrName: Linear Technology; Extra_Description: OP AMP, DUAL, R-R, 180MHZ, 8MSOP; Op Amp Type:Unity Gain Stable; No. of Amplifiers:2; Bandwidth:180MHz; Slew Rate:90V/µs; Supply Voltage Range:2.5V to 5.25V; Amplifier Case Style:MSOP; No. of Pins:8; SVHC:No SVHC (15-Dec-2010); Base Number:6247; Operating Temperature Range:0°C to +70°C / RoHS: ``Compliant`` / Slew Rate: { / ``uncertainty_minus``: null, / ``value``: 90.0, / ``uncertainty_plus``: null / } / Number of Pins: 8; Obsolete: False; Temp_Max: 0; TypeNotes: Applies to all parts in the database; PartID: 2191; mfrPartNum: LTC6254CMS#PBF-ND; URL_Image: http://cds.linear.com/images/product/4358_pack_3.jpg; URL_Datasheet: http://datasheet.octopart.com/LTC6247CMS8%23PBF-Linear-Technology-datasheet-8712476.pdf; Date_Created: 5/5/2011 9:52:24 AM; Date_LastModified: 5/5/2011 9:52:24 AM; Verified: False; RoHS: True; Temp_Min: 0; Type: All Parts
U2 U5 U11 U16 = 2192: op amp, r/r 200mhz single, soic8; no. of amplifiers:1; op amp; mfrName: Linear Technology; Extra_Description: Family	Linear - Amplifiers - Instrumentation, OP Amps, Buffer Amps / Series	- / Amplifier Type	General Purpose / Number of Circuits	1 / Output Type	Rail-to-Rail / Slew Rate	280 V/µs / Gain Bandwidth Product	720MHz / -3db Bandwidth	400MHz / Current - Input Bias	1.4µA / Voltage - Input Offset	100µV / Current - Supply	4.25mA / Current - Output / Channel	100mA / Voltage - Supply, Single/Dual (±)	2.5 V ~ 5.25 V, ±1.25 V ~ 2.625 V / Operating Temperature	-40°C ~ 125°C / Mounting Type	Surface Mount / Package / Case	SOT-23-6 Thin, TSOT-23-6 / Supplier Device Package	TSOT-23-6 / Packaging	Digi-Reel® / Other Names	LTC6252HS6#TRMPBFDKR / Alternate Package / This part is also available in the following packaging:; Obsolete: False; Temp_Max: 0; TypeNotes: Applies to all parts in the database; PartID: 2192; mfrPartNum: LTC6252; URL_Image: http://cds.linear.com/images/product/4358_pack_1.jpg; URL_Datasheet: http://datasheet.octopart.com/LTC6240CS8%23PBF-Linear-Technology-datasheet-502703.pdf; Date_Created: 5/5/2011 10:07:10 AM; Date_LastModified: 5/5/2011 10:07:10 AM; Verified: False; RoHS: True; Temp_Min: 0; Type: All Parts
U4 U14 U19 U21 = 2209: switch, spdt dual, tssop14, 636; switch type, analogue:spdt;; mfrName: Analog Devices; Extra_Description: SWITCH, SPDT DUAL, TSSOP14, 636; Switch Type, Analogue:SPDT; Switches, No. of:2; Voltage, Supply Source:Dual; Resistance, On State:85ohm; Voltage, Supply Min:2.7V; Voltage, Supply Max:5.5V; Termination Type:SMD; Case Style:TSSOP; No. of Pins:14; Operating Temperature Range:-40°C to +125°C; Base Number:636 / Mounting Type: ``Surface Mount`` / Case / Package: ``TSSOP-14`` / Packaging: ``Bulk`` / Lead-Free Status: ``Lead Free`` / RoHS: ``Compliant`` / Rds [Drain to Source Resistance] (on): { / ``uncertainty_minus``: null, / ``value``: 85.0, / ``uncertainty_plus``: null / } / Supply Voltage (DC): { / ``max_value``: 5.5, / ``max_uncertainty_plus``: null, / ``min_value``: null, / ``min_uncertainty_plus``: null, / ``max_uncertainty_minus``: null / } / Number of Channels: 2 / Number of Pins: 14; Obsolete: False; Temp_Max: 0; TypeNotes: Applies to all parts in the database; PartID: 2209; mfrPartNum: ADG636YRUZ; URL_Image: http://cdn.sigma.octopart.com/8900696/image/Analog-Devices-ADG636YRUZ.jpg; URL_Datasheet: http://datasheet.octopart.com/ADG636YRUZ-Analog-Devices-datasheet-11285.pdf; Date_Created: 5/8/2011 10:47:40 AM; Date_LastModified: 5/8/2011 10:47:40 AM; Verified: False; RoHS: True; Temp_Min: 0; Type: All Parts
U6 = 2175: mcu, 8bit, avr, 32k flash, usb, 44tqfp; eeprom memory; mfrName: Atmel; Extra_Description: MCU, 8BIT, AVR, 32K FLASH, USB, 44TQFP; EEPROM Memory Size:1KB; RAM Memory Size:2.5KB; No. of Timers:5; No. of PWM Channels:14; Operating Temperature Range:-40°C to +85°C; No. of Pins:44; Case Style:TQFP; Clock Frequency:16MHz; Flash Memory Size:32KB; Interface Type:I2C, JTAG, SPI, USART, USB; Logic Function Number:32; Max Supply Voltage:5.5V; Min Supply Voltage:2.7V; No. of ADC Inputs:12; No. of I/O Lines:26; Series:ATMEGA; Termination Type:SMD / RoHS: ``Compliant`` / Clock Speed: { / ``uncertainty_minus``: null, / ``value``: 16000000.0, / ``uncertainty_plus``: null / } / Number of Pins: 44; Obsolete: False; Temp_Max: 0; TypeNotes: Applies to all parts in the database; PartID: 2175; mfrPartNum: ATMEGA32U4-AU; URL_Image: http://cdn.sigma.octopart.com/8899375/image/Atmel-ATMEGA32U4-AU.jpg; URL_Datasheet: http://datasheet.octopart.com/ATMEGA32U4-AU-Atmel-datasheet-8370675.pdf; Date_Created: 5/4/2011 9:48:10 PM; Date_LastModified: 5/4/2011 9:48:10 PM; Verified: False; RoHS: True; Temp_Min: 0; Type: All Parts
U12 U15 U17 U18 = 2236
U20 = 2294: translator, 8 ch, 15kv esd, 3002; no. of inputs:8; output; mfrName: MAXIM; Extra_Description: TRANSLATOR, 8 CH, 15KV ESD, 3002; No. of Inputs:8; Output Current:20µA; Propagation Delay:20ns; Logic Type:Level Translator; Supply Voltage Range:1.65V to 5.5V; Logic Case Style:TSSOP; No. of Pins:20; Operating Temperature Range:-40°C to +85°C; Base Number:3002; Data Rate:20Mbps; Fall Time tf:15ns; IC Generic Number:3002; IC Temperature Range:Industrial; Logic IC Base Number:3000; Logic IC Family:Translator; Logic IC Function:8 Channel level translator; No. of Channels:8; Operating Temperature Max:85°C; Operating Temperature Min:-40°C; Package / Case:TSSOP; Rise Time:15ns; Supply Current:100nA; Supply Voltage:5.5V; Supply Voltage Max:5.5V; Supply Voltage Min:1.65V; Termination Type:SMD; Translator Type:Bidirectional level translation / Mounting Type: ``Surface Mount`` / Lead-Free Status: ``Lead Free`` / Case / Package: ``TSSOP-20`` / RoHS: ``Compliant`` / Data Rate: { / ``uncertainty_minus``: null, / ``value``: 20000000.0, / ``uncertainty_plus``: null / } / Rise Time: { / ``uncertainty_minus``: null, / ``value``: 1.5E-08, / ``uncertainty_plus``: null / } / Output Current: { / ``uncertainty_minus``: null, / ``value``: 2E-05, / ``uncertainty_plus``: null / } / Supply Voltage (DC): { / ``max_value``: 5.5, / ``max_uncertainty_plus``: null, / ``min_value``: null, / ``min_uncertainty_plus``: null, / ``max_uncertainty_minus``: null / } / Number of Pins: 20; Obsolete: False; Temp_Max: 0; TypeNotes: Applies to all parts in the database; PartID: 2294; mfrPartNum: MAX3002EUP+; URL_Image: http://cdn.sigma.octopart.com/8895021/image/Maxim-MAX3002EUP%2B.jpg; URL_Datasheet: http://datasheet.octopart.com/MAX3002EUP%2B-Maxim-datasheet-139068.pdf; Date_Created: 7/28/2011 3:37:26 AM; Date_LastModified: 7/28/2011 3:37:26 AM; Verified: False; RoHS: True; Temp_Min: 0; Type: All Parts